# EAGLE design Adapter - Cabled 2 wire [CRXB4M] (EAGLE 9.5.2)
LICENSE: CERN OHL v1.2; REV: CRXB4M; TITLE: SenseTemp 2 Wire Adapter; URL: https://github.com/CapableRobot/SenseTemp
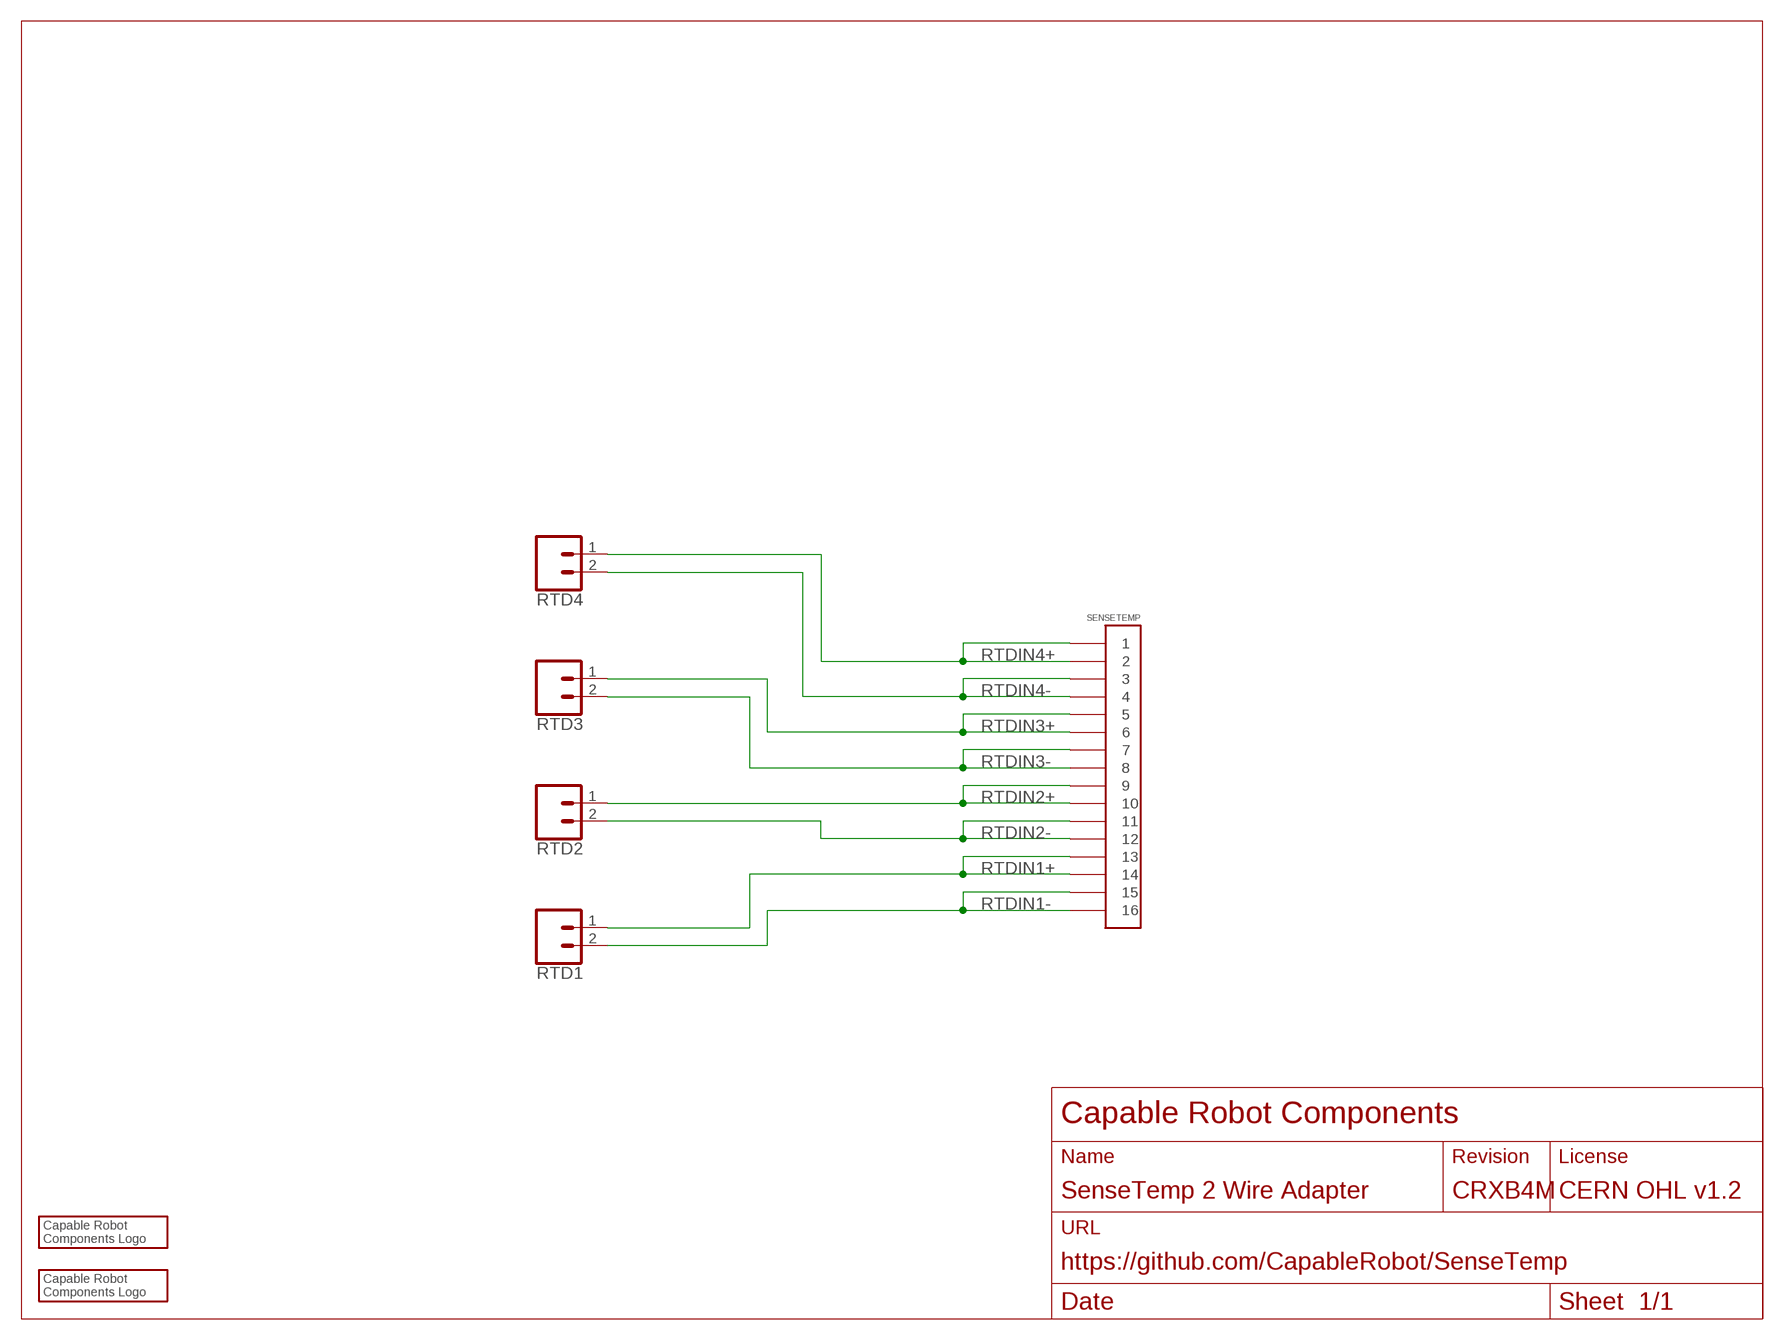
[diagram p0: schematic, sheet 1]

## Parts
LOGO1  CRC-LOGO7SILK  [CRC-LOGO-7-SILK]
LOGO2  CRC-LOGO5  [CRC-LOGO-5]
RTD1  CONN_025MM  [SCREWTERMINAL-5MM-2]
RTD2  CONN_025MM  [SCREWTERMINAL-5MM-2]
RTD3  CONN_025MM  [SCREWTERMINAL-5MM-2]
RTD4  CONN_025MM  [SCREWTERMINAL-5MM-2]
SENSETEMP  CONN-16ZT  [CONN-2X8-050-SMT-ZT]

## Nets
RTDIN1+: RTD1.1 SENSETEMP.13 SENSETEMP.14
RTDIN1-: RTD1.2 SENSETEMP.15 SENSETEMP.16
RTDIN2+: RTD2.1 SENSETEMP.9 SENSETEMP.10
RTDIN2-: RTD2.2 SENSETEMP.11 SENSETEMP.12
RTDIN3+: RTD3.1 SENSETEMP.5 SENSETEMP.6
RTDIN3-: RTD3.2 SENSETEMP.7 SENSETEMP.8
RTDIN4+: RTD4.1 SENSETEMP.1 SENSETEMP.2
RTDIN4-: RTD4.2 SENSETEMP.3 SENSETEMP.4

## Library data of the parts
LOGO1 LOGO2 = CapableRobot:CRC-LOGO
RTD1-RTD4 = SparkFun-Connectors:CONN_02: Multi connection point. Often used as Generic Header-pin footprint for 0.1 inch spaced/style header connections On any of the 0.1 inch spaced packages, you can populate with these: Break Away Headers - Straight <https://www.sparkfun.com/products/116> (PRT-00116) Break Away Male Headers - Right Angle <https://www.sparkfun.com/products/553> (PRT-00553) Female Headers <https://www.sparkfun.com/products/115> (PRT-00115) Break Away Headers - Machine Pin <https://www.sparkfun.com/products/117> (PRT-00117) Break Away Female Headers - Swiss Machine Pin <https://www.sparkfun.com/products/743> (PRT-00743) For SCREWTERMINALS and SPRING TERMINALS visit here: Screw Terimnals on SparkFun.com <https://www.sparkfun.com/search/results?term=Screw+Terminals> (5mm/3.5mm/2.54mm spacing) This device is also useful as a general connection point to wire up your design to another part of your project. Our various solder wires solder well into these plated through hole pads. Hook-Up Wire - Assortment (Stranded, 22 AWG) <https://www.sparkfun.com/products/11375> (PRT-11375) Hook-Up Wire - Assortment (Solid Core, 22 AWG) <https://www.sparkfun.com/products/11367> (PRT-11367) View the entire wire category on our website here <https://www.sparkfun.com/categories/141> Special notes: Molex polarized connector foot print use with: PRT-08233 with associated crimp pins and housings. 2.54_SCREWTERM for use with PRT-10571. 3.5mm Screw Terminal footprints for PRT-08084 5mm Screw Terminal footprints for use with PRT-08432; SF_SKU: PRT-08432
SENSETEMP = CapableRobot:CONN-16; MPN: 3221-16-0300-00

## Board
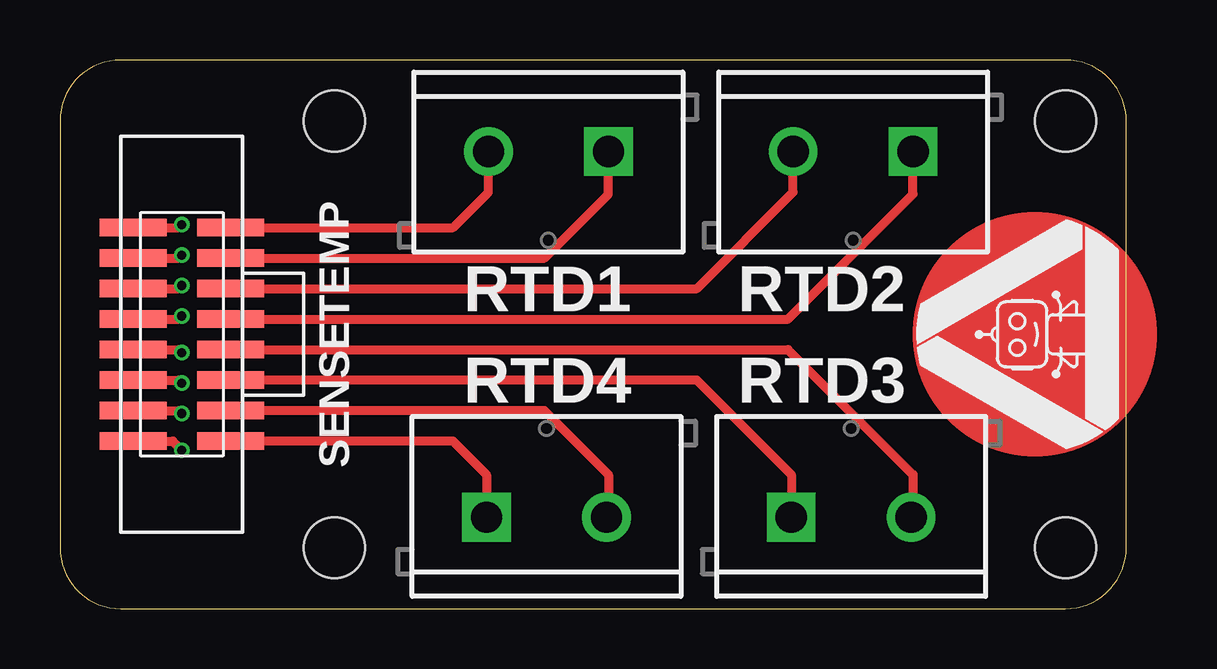
[diagram p1: board, top side]
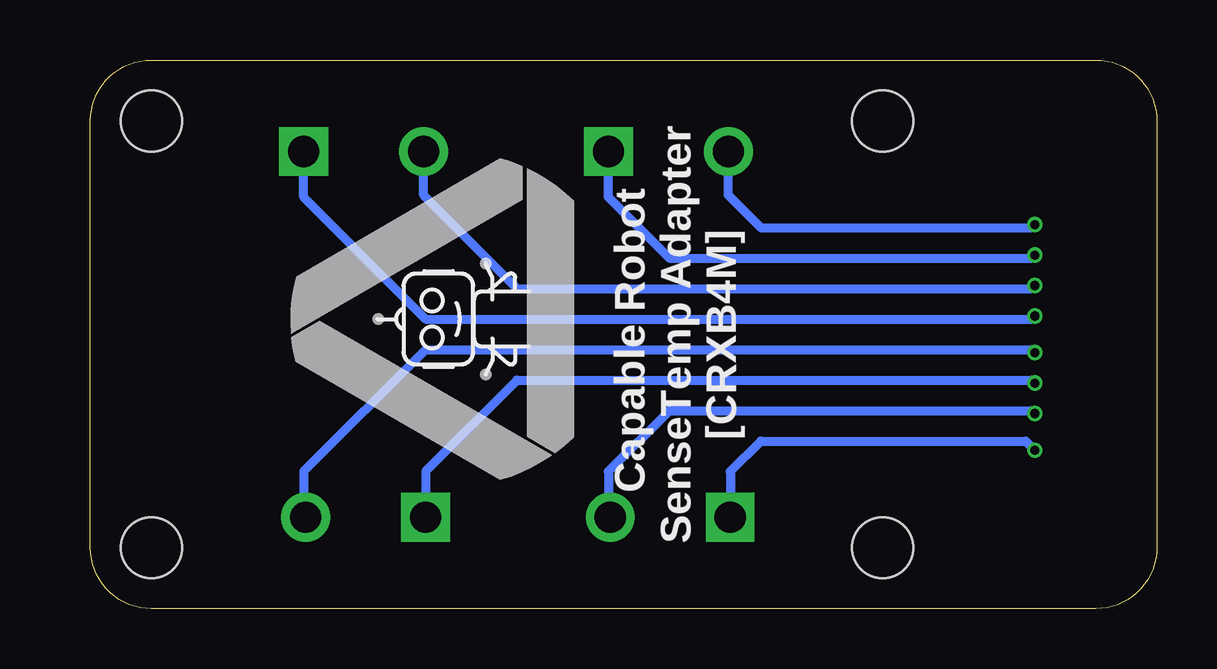
[diagram p2: board, bottom side, seen from below]

Size 44.45 x 22.86 mm. Coordinates in mm from the lower left corner, seen from the top.
Outline: 2.54,0 41.91,0 arc90 44.45,2.54 44.45,20.32 arc90 41.91,22.86 2.54,22.86 arc90 0,20.32 0,2.54 arc90 2.54,0
Copper layers (1*16): Top 0.035559375mm / dielectric 1.6mm / Bottom 0.035559375mm
Design rules "oshpark-2layer-tented *": minimum track width 6mil, minimum drill 10mil, track to track 6mil, track to pad 6mil, pad to pad 6mil, via to via 6mil, smd to smd 6mil, copper to edge 15mil, drill to drill 6mil, minimum pad ring 5mil, minimum via ring 5mil, stop-mask expansion 2.5mil, vias tented up to drill 25mil, thermal gap 10mil
Holes 2.54 mm at 11.43,2.54 11.43,20.32 41.91,20.32 41.91,2.54
tRestrict: area 8.9,0 to 14,5.1; area 8.9,17.8 to 14,22.9; area 39.4,17.8 to 44.4,22.9; area 39.4,0 to 44.4,5.1

### Footprints (pad centres in the part's own frame; a part is rotated, then mirrored left to right if it is on the bottom)
SCREWTERMINAL-5MM-2 = drill 1.3 pad 2.032 square: 1 0,0 | drill 1.3 pad 2.032: 2 5,0
CONN-2X8-050-SMT-ZT = smd 0.737 x 2.794: 1 4.445,2.032; 2 4.445,-2.032; 3 3.175,2.032; 4 3.175,-2.032; 5 1.905,2.032; 6 1.905,-2.032; 7 0.635,2.032; 8 0.635,-2.032; 9 -0.635,2.032; 10 -0.635,-2.032; 11 -1.905,2.032; 12 -1.905,-2.032; 13 -3.175,2.032; 14 -3.175,-2.032; 15 -4.445,2.032; 16 -4.445,-2.032

### Placement (x,y rotation side)
LOGO1  29.2,12.07 90 bottom
LOGO2  40.64,11.43 90 top
RTD1  22.86,19.05 180 top
RTD2  35.56,19.05 180 top
RTD3  30.48,3.81 0 top
RTD4  17.78,3.81 0 top
SENSETEMP  5.08,11.43 270 top

### Tracks (layer width: path | path; a pad name or v marks a point on that pad's centre or on a via)
RTDIN1+  (via drill 0.38)
  Top 0.381: RTD1.1 22.86,17.27 20.19,14.61 SENSETEMP.13 | SENSETEMP.14 4.95,14.61 v5.08,14.73
  Bottom 0.381: RTD1.1 22.86,17.14 20.32,14.61 5.21,14.61 v5.08,14.73
RTDIN1-  (via drill 0.38)
  Top 0.381: RTD1.2 17.86,17.35 16.38,15.88 SENSETEMP.15 | SENSETEMP.16 4.95,15.88 v5.08,16
  Bottom 0.381: RTD1.2 17.86,17.23 16.51,15.88 5.21,15.88 v5.08,16
RTDIN2+  (via drill 0.38)
  Top 0.381: RTD2.1 35.56,17.27 30.35,12.06 SENSETEMP.9 | SENSETEMP.10 4.95,12.06 v5.08,12.19
  Bottom 0.381: RTD2.1 35.56,17.14 30.48,12.06 5.21,12.06 v5.08,12.19
RTDIN2-  (via drill 0.38)
  Top 0.381: RTD2.2 30.56,17.35 26.54,13.34 SENSETEMP.11 | SENSETEMP.12 4.95,13.34 v5.08,13.46
  Bottom 0.381: RTD2.2 30.56,17.23 26.67,13.34 5.21,13.34 v5.08,13.46
RTDIN3+  (via drill 0.38)
  Top 0.381: RTD3.1 30.48,5.59 26.54,9.53 SENSETEMP.5 | SENSETEMP.6 4.95,9.53 v5.08,9.4
  Bottom 0.381: RTD3.1 30.48,5.71 26.67,9.53 5.21,9.53 v5.08,9.4
RTDIN3-  (via drill 0.38)
  Top 0.381: RTD3.2 35.56,3.89 35.56,5.59 30.35,10.79 SENSETEMP.7 | SENSETEMP.8 4.95,10.79 v5.08,10.67
  Bottom 0.381: RTD3.2 35.56,3.89 35.56,5.71 30.48,10.79 5.21,10.79 v5.08,10.67
RTDIN4+  (via drill 0.38)
  Top 0.381: RTD4.1 17.78,5.59 16.38,6.99 SENSETEMP.1 | SENSETEMP.2 4.7,6.99 v5.08,6.6
  Bottom 0.381: RTD4.1 17.78,5.71 16.51,6.99 5.46,6.99 v5.08,6.6
RTDIN4-  (via drill 0.38)
  Top 0.381: RTD4.2 22.86,3.89 22.86,5.59 20.19,8.26 SENSETEMP.3 | SENSETEMP.4 4.95,8.26 v5.08,8.13
  Bottom 0.381: RTD4.2 22.86,3.89 22.86,5.71 20.32,8.26 5.21,8.26 v5.08,8.13
(copper drawn outside any net)
  shapes: Top circle x1

### Text on the board
bPlace: Capable Robot / SenseTemp Adapter / [CRXB4M]